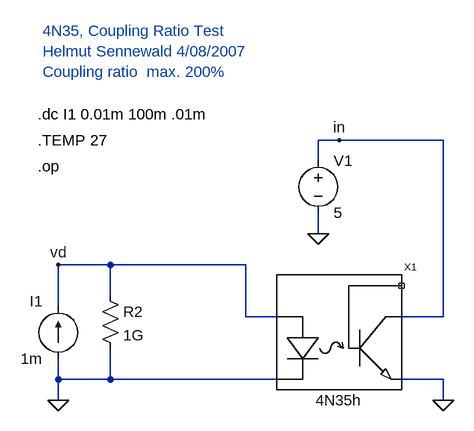
[diagram p0: schematic 4n35h_cr_test.asc]
4n35h_cr_test.asc, the LTspice schematic file:
Version 4
SHEET 1 2328 1460
WIRE 432 528 400 528
WIRE 592 528 432 528
WIRE 400 560 400 528
WIRE 400 672 400 640
WIRE 80 720 0 720
WIRE 288 720 80 720
WIRE 80 768 80 720
WIRE 0 784 0 720
WIRE 288 800 288 720
WIRE 336 800 288 800
WIRE 592 800 592 528
WIRE 592 800 528 800
WIRE 0 896 0 864
WIRE 80 896 80 848
WIRE 80 896 0 896
WIRE 336 896 80 896
WIRE 592 896 528 896
WIRE 0 928 0 896
WIRE 592 928 592 896
FLAG 400 672 0
FLAG 0 928 0
FLAG 592 928 0
FLAG 432 528 in
FLAG 0 720 vd
SYMBOL voltage 400 544 R0
SYMATTR InstName V1
SYMATTR Value 5
SYMBOL current 0 864 R180
WINDOW 0 24 88 Left 0
WINDOW 3 24 0 Left 0
WINDOW 123 0 0 Left 0
WINDOW 39 0 0 Left 0
SYMATTR InstName I1
SYMATTR Value 1m
SYMBOL res 64 752 R0
SYMATTR InstName R2
SYMATTR Value 1G
SYMBOL 4n35h 432 848 R0
SYMATTR InstName X1
TEXT -24 360 Left 0 ;4N35, Coupling Ratio Test\nHelmut Sennewald 4/08/2007\nCoupling ratio  max. 200%
TEXT -32 488 Left 0 !.dc I1 0.01m 100m .01m
TEXT -32 568 Left 0 !.op
TEXT -32 528 Left 0 !.TEMP 27

The netlist it stands for:
* 4n35h_cr_test.asc
V1 in 0 5
I1 0 vd 1m
R2 vd 0 1G
XX1 vd 0 0 in NC_01 4n35h params: 4N35h  ; pins A K E C B
* 4N35, Coupling Ratio Test
* Helmut Sennewald 4/08/2007
* Coupling ratio  max. 200%
.dc I1 0.01m 100m .01m
.op
.TEMP 27
.backanno
.end